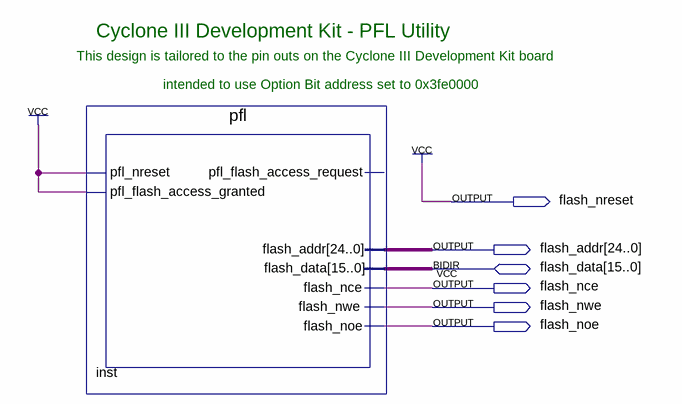
[diagram p0: schematic sheet]
// Quartus schematic cycloneIII_3c120_dev_pfl_top.bdf as structural Verilog: 1 symbols, 6 pins
module cycloneIII_3c120_dev_pfl_top (
  inout  [15:0] flash_data,
  output flash_nreset,
  output [24:0] flash_addr,
  output flash_nce,
  output flash_nwe,
  output flash_noe
);

  pfl inst (
    .pfl_nreset(1'b1), .pfl_flash_access_granted(1'b1), .flash_addr(flash_addr), .flash_nce(flash_nce),
    .flash_nwe(flash_nwe), .flash_noe(flash_noe), .flash_data(flash_data));  // open: pfl_flash_access_request

  assign flash_nreset = 1'b1;

  // Notes on the sheet:
  //   Cyclone III Development Kit - PFL Utility
  //   This design is tailored to the pin outs on the Cyclone III Development Kit board
  //   intended to use Option Bit address set to 0x3fe0000
endmodule
